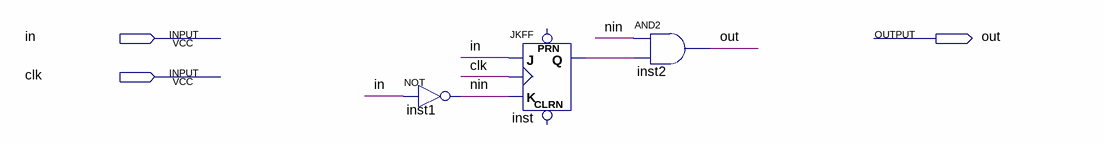
[diagram p0: schematic sheet]
// Quartus schematic FallingEdge.bdf as structural Verilog: 3 symbols, 3 pins
module FallingEdge (
  input  in,
  input  clk,
  output out
);

  wire inst_q, nin;

  not inst1 (nin, in);
  JKFF inst (.K(nin), .J(in), .CLK(clk), .Q(inst_q));  // open: PRN, CLRN
  and inst2 (out, nin, inst_q);
endmodule
